# EAGLE design controlador_valvulas (EAGLE 7.2.0)
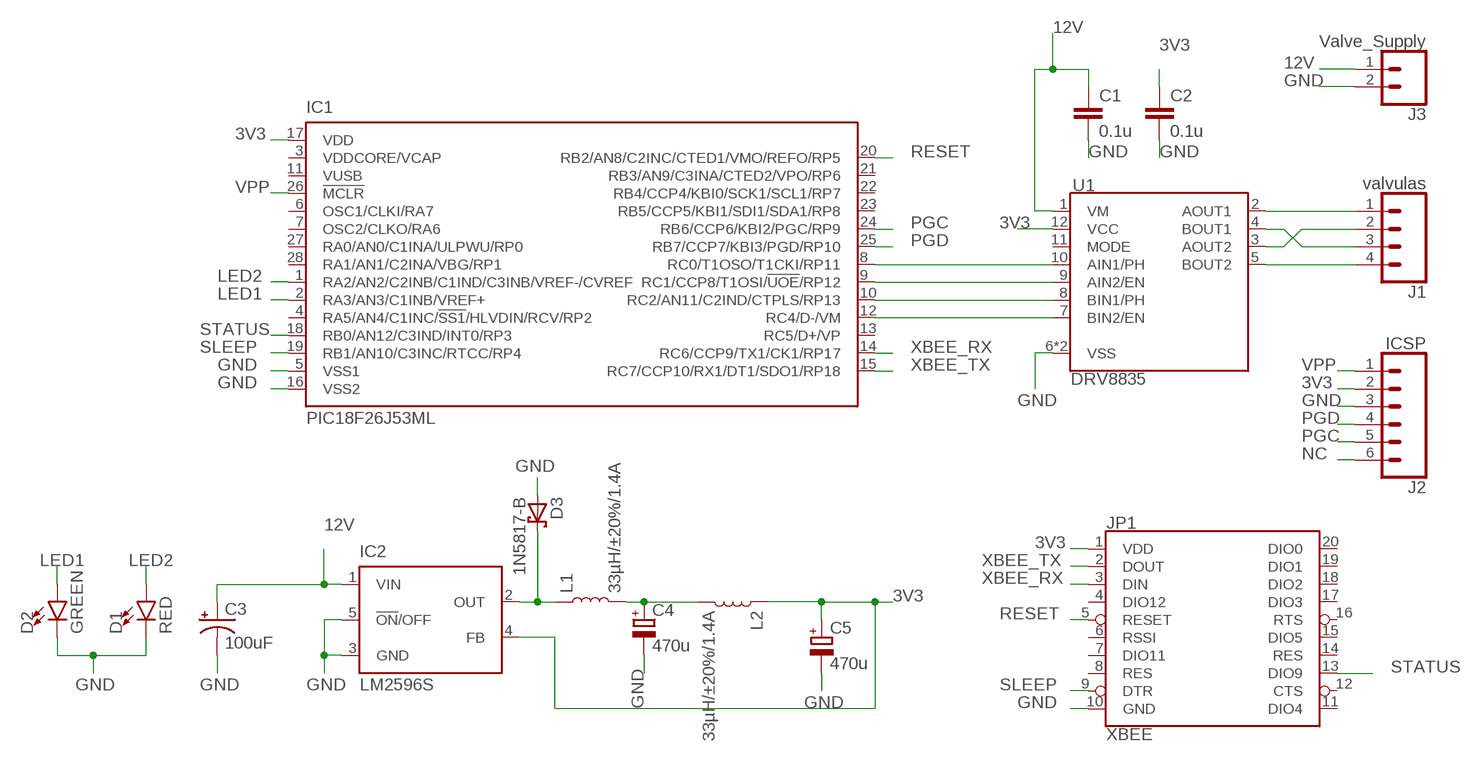
[diagram p0: schematic, sheet 1]

## Parts
C1  0.1u  C-EUC0805K  [C0805K]
C2  0.1u  C-EUC0805K  [C0805K]
C3  100uF  100UF-POLAR-EIA7343-10V-10%(TANT)  [EIA7343]
C4  470u  CPOL-EUCT7343  [CT7343]
C5  470u  CPOL-EUCT7343  [CT7343]
D1  RED  LED-RED1206  [LED-1206]
D2  GREEN  LED-GREEN1206  [LED-1206]
D3  1N5817-B  [DO41-7.6]
IC1  PIC18F26J53ML  [QFN28-ML_6X6MM]
IC2  LM2596S  [TO263-5]
J1  valvulas  CONN_04  [1X04]
J2  ICSP  CONN_06LONGPADS  [1X06_LONGPADS]
J3  Valve_Supply  CONN_02  [1X02]
JP1  XBEE  XBEELONGPAD  [XBEE-LONGPAD]
L1  33µH/±20%/1.4A  INDUCTOR-SRN6045-33UH  [SRN6045]
L2  33µH/±20%/1.4A  INDUCTOR-SRN6045-33UH  [SRN6045]
U1  DRV8835  DRV883X  [WSON-12]

## Nets
3V3: C2.1 C5.+ IC1.17(VDD) IC2.4(FB) J2.2 JP1.1(VDD) L2.1 U1.12(VCC)
12V: C1.1 C3.A(+) IC2.1(VIN) J3.1 U1.1(VM)
GND: C1.2 C2.2 C3.C(-) C4.- C5.- D1.C D2.C D3.A IC1.5(VSS1) IC1.16(VSS2) IC2.3(GND) IC2.5(!ON!/OFF) J2.3 J3.2 JP1.10(GND) U1.6(VSS) U1.PAD(VSS)
LED1: D2.A IC1.2(RA3/AN3/C1INB/VREF+)
LED2: D1.A IC1.1(RA2/AN2/C2INB/C1IND/C3INB/VREF-/CVREF)
N$1: IC1.8(RC0/T1OSO/T1CKI/RP11) U1.10(AIN1/PH)
N$2: IC1.9(RC1/CCP8/T1OSI/!UOE!/RP12) U1.9(AIN2/EN)
N$3: IC1.10(RC2/AN11/C2IND/CTPLS/RP13) U1.8(BIN1/PH)
N$4: IC1.12(RC4/D-/VM) U1.7(BIN2/EN)
N$5: J1.1 U1.2(AOUT1)
N$6: J1.3 U1.4(BOUT1)
N$7: J1.2 U1.3(AOUT2)
N$8: J1.4 U1.5(BOUT2)
N$9: D3.C IC2.2(OUT) L1.1
N$10: C4.+ L1.2 L2.2
NC: J2.6
PGC: IC1.24(RB6/CCP6/KBI2/PGC/RP9) J2.5
PGD: IC1.25(RB7/CCP7/KBI3/PGD/RP10) J2.4
RESET: IC1.20(RB2/AN8/C2INC/CTED1/VMO/REFO/RP5) JP1.5(RESET)
SLEEP: IC1.19(RB1/AN10/C3INC/RTCC/RP4) JP1.9(DTR)
STATUS: IC1.18(RB0/AN12/C3IND/INT0/RP3) JP1.13(DIO9)
VPP: IC1.26(!MCLR) J2.1
XBEE_RX: IC1.14(RC6/CCP9/TX1/CK1/RP17) JP1.3(DIN)
XBEE_TX: IC1.15(RC7/CCP10/RX1/DT1/SDO1/RP18) JP1.2(DOUT)
Unconnected: IC1.3(VDDCORE/VCAP) IC1.4(RA5/AN4/C1INC/!SS1!/HLVDIN/RCV/RP2) IC1.6(OSC1/CLKI/RA7) IC1.7(OSC2/CLKO/RA6) IC1.11(VUSB) IC1.13(RC5/D+/VP) IC1.21(RB3/AN9/C3INA/CTED2/VPO/RP6) IC1.22(RB4/CCP4/KBI0/SCK1/SCL1/RP7) IC1.23(RB5/CCP5/KBI1/SDI1/SDA1/RP8) IC1.27(RA0/AN0/C1INA/ULPWU/RP0) IC1.28(RA1/AN1/C2INA/VBG/RP1) JP1.4(DIO12) JP1.6(RSSI) JP1.7(DIO11) JP1.8(RES) JP1.11(DIO4) JP1.12(CTS) JP1.14(RES) JP1.15(DIO5) JP1.16(RTS) JP1.17(DIO3) JP1.18(DIO2) JP1.19(DIO1) JP1.20(DIO0) U1.11(MODE)

## Library data of the parts
C1 C2 = rcl:C-EU: CAPACITOR, European symbol
C3 = SparkFun-Capacitors:100UF-POLAR: 100µF polarized capacitors A capacitor is a passive two-terminal electrical component used to store electrical energy temporarily in an electric field.; PROD_ID: CAP-07890
C4 C5 = rcl:CPOL-EU: POLARIZED CAPACITOR, European symbol
D1 = SparkFun-LED:LED-RED: Red SMD LED Used in manufacturing of most products at SparkFun Packages: 0603 - SMD 0603 package [Product Link] <http://docs.avagotech.com/docs/AV02-0551EN> 0603 SMART - SMD 0603 SMART package ( more efficient and expensive)[Product Link] <http://www.osram-os.com/Graphics/XPic2/00077099_0.pdf> 1206 - SMD1206 package [Product Link] <https://www.sparkfun.com/datasheets/DevTools/LilyPad/Q150OVS4.pdff> SparkFun Products: Pro Mini 328 -5V <https://www.sparkfun.com/products/821> RedBoard <https://www.sparkfun.com/products/12757> IOIO-OTG <https://www.sparkfun.com/products/13613>; PROD_ID: DIO-09912
D2 = SparkFun-LED:LED-GREEN: Green SMD LED Used in manufacturing of various products at SparkFun Packages: 0603 - SMD 0603 package [Product Link] <http://www.futureelectronics.com/en/technologies/semiconductors/optoelectronics/leds/Pages/9894312-LTST-C190GKT.aspx?CrossPart=HSMG-C190&IM=0> LilyPad 1206 - SMD1206 LilyPad package [Product Link] <http://www.futureelectronics.com/en/Technologies/Product.aspx?ProductID=IN150NGHARVATEKCORPORATION2049943&IM=0> 1206 - SMD1206 package [Product Link] <http://www.futureelectronics.com/en/technologies/semiconductors/optoelectronics/leds/Pages/8315665-LTST-C150KGKT.aspx?IM=0> 1206 Bottom Mount -SMD 1206 Bottom Mount [Product Link] <http://www.digikey.com/product-detail/en/lite-on-inc/LTST-C230KGKT/160-1456-1-ND/386854> SparkFun Products: Pro Mini 328 -5V <https://www.sparkfun.com/products/821> RedBoard <https://www.sparkfun.com/products/12757> MP3 Trigger <https://www.sparkfun.com/products/13720> Makey Makey <https://www.sparkfun.com/products/11076>; PROD_ID: DIO-00862
D3 = diode:1N581*: 1.0A SCHOTTKY BARRIER RECTIFIER Source: http://www.diodes.com/datasheets/ds23001.pdf
IC1 = microchip:PIC18F2*J53: PIC18F47J53 Family High-Performance USB Microcontrollers with nanoWatt XLP Technology Source: Data sheet <http://ww1.microchip.com/downloads/en/DeviceDoc/39964B.pdf>; MPN: PIC18F26J53-I/ML; OC_FARNELL: unknown; OC_NEWARK: 63R7829
IC2 = national-semiconductor:LM2596: SIMPLE SWITCHER® Power Converter 150 kHz 3A Step-Down Voltage Regulator Source: http://www.national.com/ds/LM/LM2596.pdf; MF: NATIONAL SEMICONDUCTOR; MPN: LM2596S-ADJ/NOPB; OC_FARNELL: 9494367; OC_NEWARK: 41K3842
J1 = SparkFun-Connectors:CONN_04: Multi connection point. Often used as Generic Header-pin footprint for 0.1 inch spaced/style header connections On any of the 0.1 inch spaced packages, you can populate with these: Break Away Headers - Straight <https://www.sparkfun.com/products/116> (PRT-00116) Break Away Male Headers - Right Angle <https://www.sparkfun.com/products/553> (PRT-00553) Female Headers <https://www.sparkfun.com/products/115> (PRT-00115) Break Away Headers - Machine Pin <https://www.sparkfun.com/products/117> (PRT-00117) Break Away Female Headers - Swiss Machine Pin <https://www.sparkfun.com/products/743> (PRT-00743) For SCREWTERMINALS and SPRING TERMINALS visit here: Screw Terimnals on SparkFun.com <https://www.sparkfun.com/search/results?term=Screw+Terminals> (5mm/3.5mm/2.54mm spacing) This device is also useful as a general connection point to wire up your design to another part of your project. Our various solder wires solder well into these plated through hole pads. Hook-Up Wire - Assortment (Stranded, 22 AWG) <https://www.sparkfun.com/products/11375> (PRT-11375) Hook-Up Wire - Assortment (Solid Core, 22 AWG) <https://www.sparkfun.com/products/11367> (PRT-11367) View the entire wire category on our website here <https://www.sparkfun.com/categories/141> Special notes: Molex polarized connector foot print use with SKU : PRT-08231 with associated crimp pins and housings. 1MM SMD Version SKU: PRT-10208; PROD_ID: CONN-09696
J2 = SparkFun-Connectors:CONN_06: Multi connection point. Often used as Generic Header-pin footprint for 0.1 inch spaced/style header connections On any of the 0.1 inch spaced packages, you can populate with these: Break Away Headers - Straight <https://www.sparkfun.com/products/116> (PRT-00116) Break Away Male Headers - Right Angle <https://www.sparkfun.com/products/553> (PRT-00553) Female Headers <https://www.sparkfun.com/products/115> (PRT-00115) Break Away Headers - Machine Pin <https://www.sparkfun.com/products/117> (PRT-00117) Break Away Female Headers - Swiss Machine Pin <https://www.sparkfun.com/products/743> (PRT-00743) Arduino Stackable Header - 6 Pin <https://www.sparkfun.com/products/9280> (PRT-09280) For SCREWTERMINALS and SPRING TERMINALS visit here: Screw Terimnals on SparkFun.com <https://www.sparkfun.com/search/results?term=Screw+Terminals> (5mm/3.5mm/2.54mm spacing) This device is also useful as a general connection point to wire up your design to another part of your project. Our various solder wires solder well into these plated through hole pads. Hook-Up Wire - Assortment (Stranded, 22 AWG) <https://www.sparkfun.com/products/11375> (PRT-11375) Hook-Up Wire - Assortment (Solid Core, 22 AWG) <https://www.sparkfun.com/products/11367> (PRT-11367) View the entire wire category on our website here <https://www.sparkfun.com/categories/141>
J3 = SparkFun-Connectors:CONN_02: Multi connection point. Often used as Generic Header-pin footprint for 0.1 inch spaced/style header connections On any of the 0.1 inch spaced packages, you can populate with these: Break Away Headers - Straight <https://www.sparkfun.com/products/116> (PRT-00116) Break Away Male Headers - Right Angle <https://www.sparkfun.com/products/553> (PRT-00553) Female Headers <https://www.sparkfun.com/products/115> (PRT-00115) Break Away Headers - Machine Pin <https://www.sparkfun.com/products/117> (PRT-00117) Break Away Female Headers - Swiss Machine Pin <https://www.sparkfun.com/products/743> (PRT-00743) For SCREWTERMINALS and SPRING TERMINALS visit here: Screw Terimnals on SparkFun.com <https://www.sparkfun.com/search/results?term=Screw+Terminals> (5mm/3.5mm/2.54mm spacing) This device is also useful as a general connection point to wire up your design to another part of your project. Our various solder wires solder well into these plated through hole pads. Hook-Up Wire - Assortment (Stranded, 22 AWG) <https://www.sparkfun.com/products/11375> (PRT-11375) Hook-Up Wire - Assortment (Solid Core, 22 AWG) <https://www.sparkfun.com/products/11367> (PRT-11367) View the entire wire category on our website here <https://www.sparkfun.com/categories/141> Special notes: Molex polarized connector foot print use with: PRT-08233 with associated crimp pins and housings. 2.54_SCREWTERM for use with PRT-10571. 3.5mm Screw Terminal footprints for PRT-08084 5mm Screw Terminal footprints for use with PRT-08432
JP1 = SparkFun-RF:XBEE: Digi XBee and XBee Pro XBees are tiny blue chips that can communicate wirelessly with each other. They can do simple things, like replacing a couple of wires in serial communication, which is nice when you want to make a remote for your paintball vehicle. SparkFun Products SparkFun XBee Buying Guide <https://www.sparkfun.com/pages/xbee_guide> SparkFun XBee Explorer USB <https://www.sparkfun.com/products/11812> (WRL-11812) Breakout Board for XBee Module <https://www.sparkfun.com/products/8276> (WRL-8276) SparkFun XBee Explorer Regulated <https://www.sparkfun.com/products/11373> (WRL-11373) SparkFun XBee Explorer Dongle <https://www.sparkfun.com/products/11697> (WRL-11697) SparkFun XBee Shield <https://www.sparkfun.com/products/12847> (WRL-12847) SparkFun XBee Explorer Serial <https://www.sparkfun.com/products/13225> (WRL-13225)
L1 L2 = SparkFun-Coils:INDUCTOR: Inductors Resist changes in electrical current. Basically a coil of wire. SparkFun Products: SparkFun Load Cell Amplifier - HX711 <https://www.sparkfun.com/products/13879> IOIO-OTG - V2.2 <https://www.sparkfun.com/products/13613>; PROD_ID: NDUC-11627
U1 = SparkFun-IC-Special-Function:DRV883X: DRV8835 2 Channel Motor Driver Dual 1.5A H-bridge, 2-11V Datasheet <http://www.ti.com/lit/ds/symlink/drv8835.pdf> SparkFun Products: SparkFun Serial Controlled Motor Driver <https://www.sparkfun.com/products/13911>; PROD_ID: IC-13342

## Board
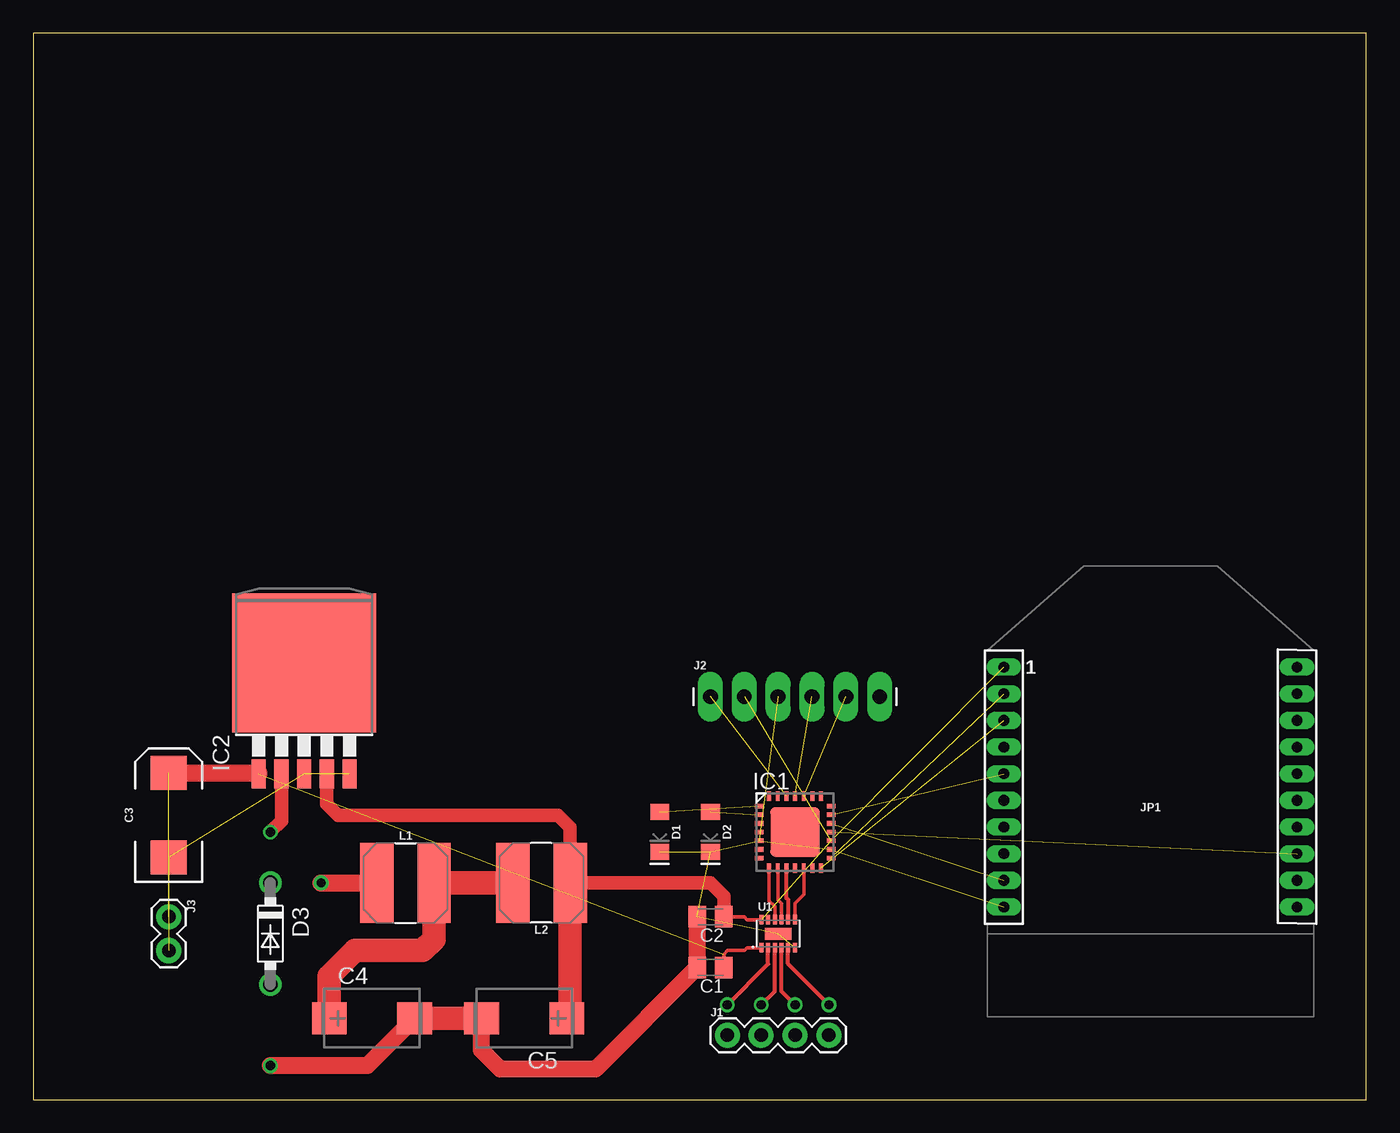
[diagram p1: board, top side]
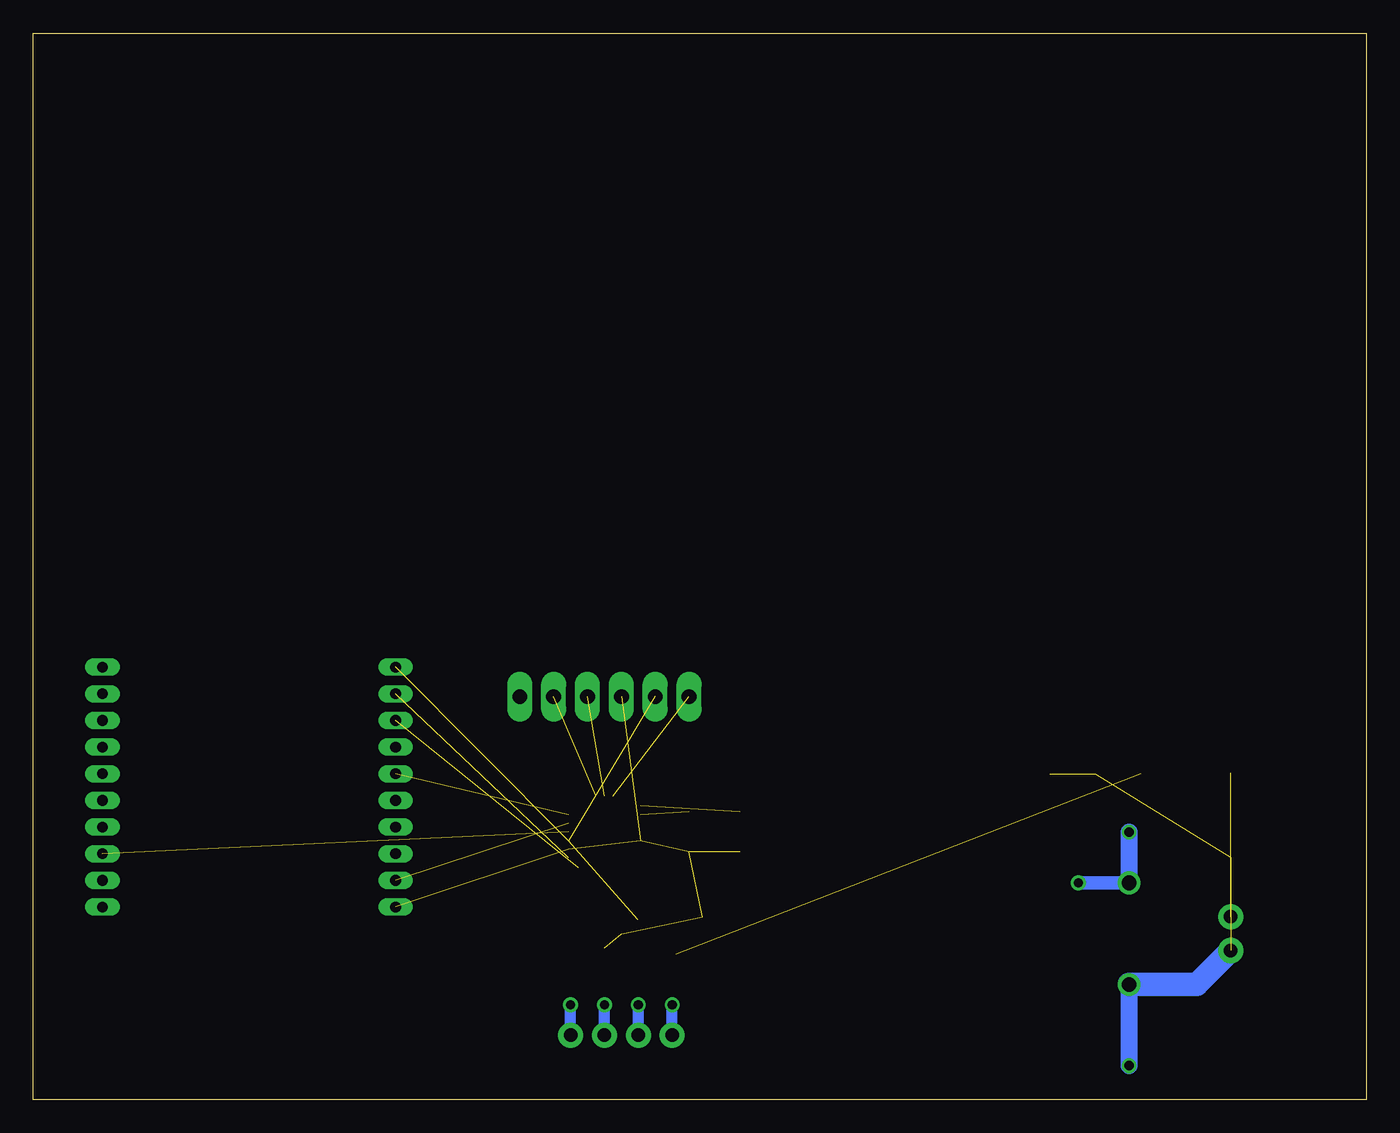
[diagram p2: board, bottom side, seen from below]

Size 100 x 80 mm. Coordinates in mm from the lower left corner, seen from the top.
Outline: 0,0 100,0 100,80 0,80 0,0
Copper layers (1*16): Top 0.035mm / dielectric 1.5mm / Bottom 0.035mm
Design rules "default *": minimum track width 10mil, minimum drill 24mil, track to track 7mil, track to pad 7mil, pad to pad 7mil, via to via 8mil, smd to smd 7mil, copper to edge 40mil, drill to drill 8mil, minimum pad ring 10mil, minimum via ring 8mil, stop-mask expansion 4mil, vias tented up to drill 0mil, thermal gap 10mil

### Footprints (pad centres in the part's own frame; a part is rotated, then mirrored left to right if it is on the bottom)
C0805K = smd 1.3 x 1.6: 1 -1,0; 2 1,0
EIA7343 = smd 2.55 x 2.7: A 3.17,0; C -3.17,0
CT7343 = smd 2.6 x 2.4: + -3.2,0; - 3.2,0
LED-1206 = smd 1.2 x 1.4: A -1.5,0; C 1.5,0
DO41-7.6 = drill 1.1 pad 1.7: A 3.81,0; C -3.81,0
QFN28-ML_6X6MM = smd 0.7 x 0.35: 1 -2.7,1.95; 2 -2.7,1.3; 3 -2.7,0.65; 4 -2.7,0; 5 -2.7,-0.65; 6 -2.7,-1.3; 7 -2.7,-1.95; 15 2.7,-1.95; 16 2.7,-1.3; 17 2.7,-0.65; 18 2.7,0; 19 2.7,0.65; 20 2.7,1.3; 21 2.7,1.95 | smd 0.35 x 0.7: 8 -1.95,-2.7; 9 -1.3,-2.7; 10 -0.65,-2.7; 11 0,-2.7; 12 0.65,-2.7; 13 1.3,-2.7; 14 1.95,-2.7; 22 1.95,2.7; 23 1.3,2.7; 24 0.65,2.7; 25 0,2.7; 26 -0.65,2.7; 27 -1.3,2.7; 28 -1.95,2.7 | smd 3.7 x 3.7: EXP 0,0
TO263-5 = smd 1.067 x 2.159: 1 -3.404,-5.791; 2 -1.702,-5.791; 3 0,-5.791; 4 1.702,-5.791; 5 3.404,-5.791 | smd 10.8 x 10.41: 6 0,2.54
1X04 = drill 1.016 pad 1.88: 1 0,0; 2 2.54,0; 3 5.08,0; 4 7.62,0
1X06_LONGPADS = drill 1.118 pad 1.88 long: 1 0,0; 2 2.54,0; 3 5.08,0; 4 7.62,0; 5 10.16,0; 6 12.7,0
1X02 = drill 1.016 pad 1.88: 1 0,0; 2 2.54,0
XBEE-LONGPAD = drill 0.8 pad 1.206 long: 1 -11,20; 2 -11,18; 3 -11,16; 4 -11,14; 5 -11,12; 6 -11,10; 7 -11,8; 8 -11,6; 9 -11,4; 10 -11,2; 11 11,2; 12 11,4; 13 11,6; 14 11,8; 15 11,10; 16 11,12; 17 11,14; 18 11,16; 19 11,18; 20 11,20
SRN6045 = smd 2.5 x 6: 1 -2.175,0; 2 2.125,0
WSON-12 = smd 0.3 x 0.7: 1 -1.25,-1.05; 2 -0.75,-1.05; 3 -0.25,-1.05; 4 0.25,-1.05; 5 0.75,-1.05; 6 1.25,-1.05; 7 1.25,1.05; 8 0.75,1.05; 9 0.25,1.05; 10 -0.25,1.05; 11 -0.75,1.05; 12 -1.25,1.05 | smd 2 x 0.9: PAD 0,0

### Placement (x,y rotation side)
C1  50.8,9.91 180 top
C2  50.8,13.72 180 top
C3  10.16,21.34 90 top
C4  25.4,6.1 0 top
C5  36.83,6.1 180 top
D1  46.99,20.07 270 top
D2  50.8,20.07 270 top
D3  17.78,12.45 270 top
IC1  57.15,20.07 0 top
IC2  20.32,30.23 0 top
J1  52.07,4.83 0 top
J2  50.8,30.23 0 top
J3  10.16,13.72 270 top
JP1  83.82,12.45 0 top
L1  27.94,16.26 0 top
L2  38.1,16.26 180 top
U1  55.88,12.45 0 top

### Tracks (layer width: path | path; a pad name or v marks a point on that pad's centre or on a via)
3V3  (3 unrouted)
  Top 0.254: U1.12 53.56,13.5 53.34,13.72 C2.1
  Top 1.016: IC2.4 22.02,22.17 22.86,21.34 39.37,21.34 40.27,20.43 L2.1 50.8,16.26 51.8,15.26 C2.1
  Top 1.778: C5.+ 40.27,6.34 L2.1
12V  (2 unrouted)
  Top 0.254: U1.1 53.56,11.4 53.34,11.18 52.07,11.18 51.8,10.91 C1.1
  Top 1.27: C3.A 16.92,24.51 IC2.1
GND  (via drill 0.7)  (11 unrouted)
  Top 1.27: C2.2 C1.2 42.18,2.29 35.05,2.29 33.63,3.71 C5.- | C4.- 25.04,2.54 v17.78,2.54
  Top 1.778: C5.- C4.-
  Bottom 1.27: v17.78,2.54 D3.A
  Bottom 1.778: D3.A 12.7,8.64 J3.2
LED1  (1 unrouted)
LED2  (1 unrouted)
N$1
  Top 0.254: IC1.8 55.2,14.9 55.63,14.48 U1.10
N$2
  Top 0.254: U1.9 56.13,14.74 55.88,14.99 55.88,17.34 IC1.9
N$3
  Top 0.305: U1.8 56.64,13.51 56.64,14.99 56.5,15.13 IC1.10
N$4
  Top 0.254: U1.7 57.15,13.52 57.15,14.73 57.8,15.38 IC1.12
N$5  (via drill 0.7)
  Top 0.305: v52.07,7.11 55.13,10.17 U1.2
  Bottom 0.813: J1.1 v52.07,7.11
N$6  (via drill 0.7)
  Top 0.305: v57.15,7.11 56.13,8.13 U1.4
  Bottom 0.813: J1.3 v57.15,7.11
N$7  (via drill 0.7)
  Top 0.305: v54.61,7.11 55.63,8.13 U1.3
  Bottom 0.813: J1.2 v54.61,7.11
N$8  (via drill 0.7)
  Top 0.305: v59.69,7.11 56.63,10.17 U1.5
  Bottom 0.813: J1.4 v59.69,7.11
N$9  (via drill 0.7)
  Top 1.016: v17.78,20.07 18.62,20.9 IC2.2
  Top 1.27: v21.59,16.26 L1.1
  Bottom 1.016: D3.C v21.59,16.26
  Bottom 1.27: D3.C v17.78,20.07
N$10
  Top 1.778: L2.2 L1.2 30.07,12.03 29.21,11.18 24.13,11.18 22.2,9.25 C4.+
PGC  (1 unrouted)
PGD  (1 unrouted)
RESET  (1 unrouted)
SLEEP  (1 unrouted)
STATUS  (1 unrouted)
VPP  (1 unrouted)
XBEE_RX  (1 unrouted)
XBEE_TX  (1 unrouted)